# EAGLE schematic proyecto (EAGLE 9.6.2)
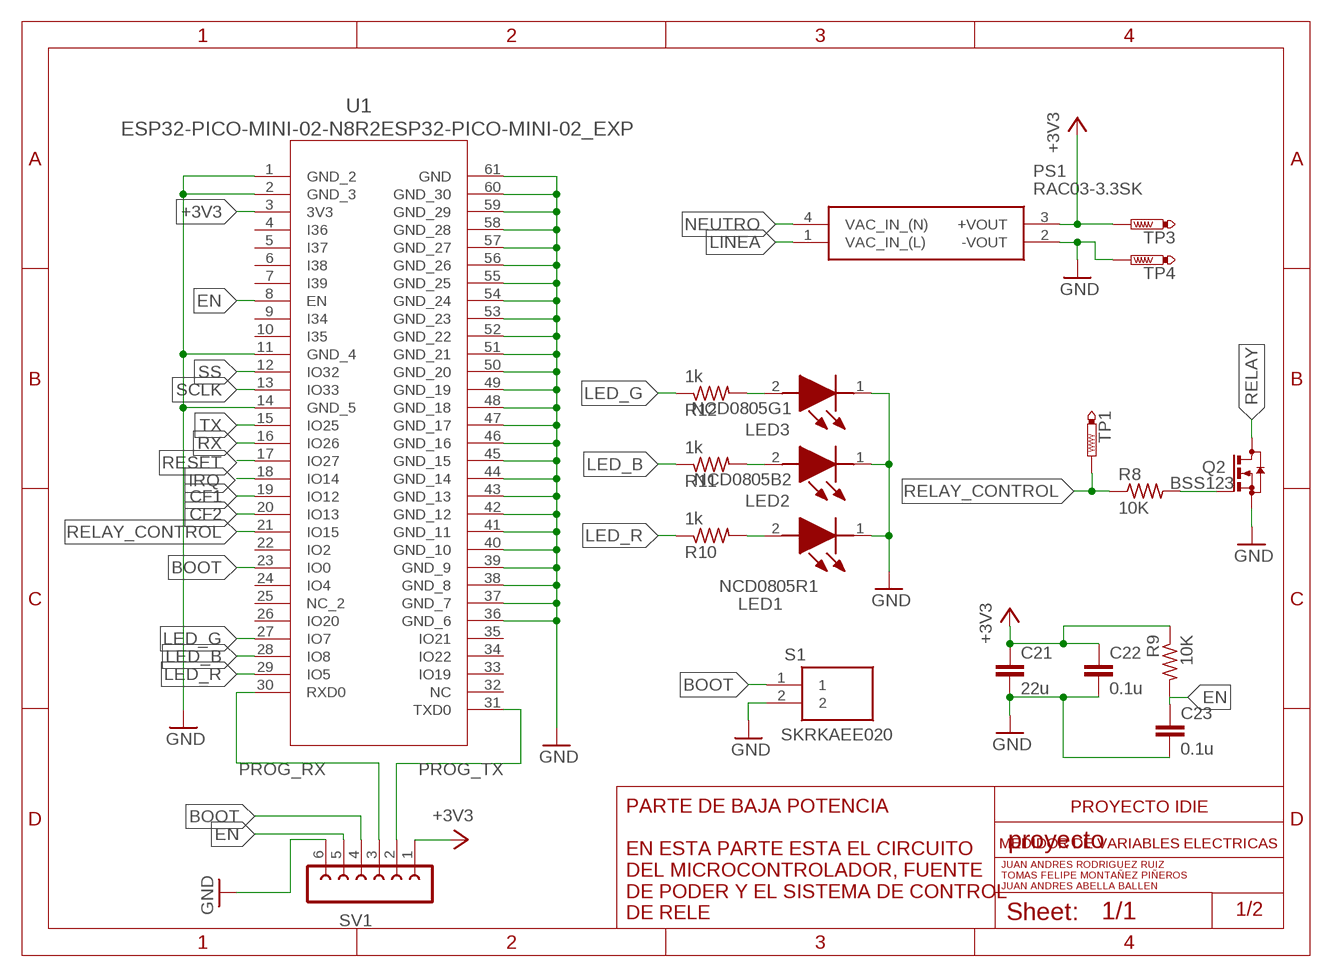
[diagram p0: schematic, sheet 1, part 1 of 2]
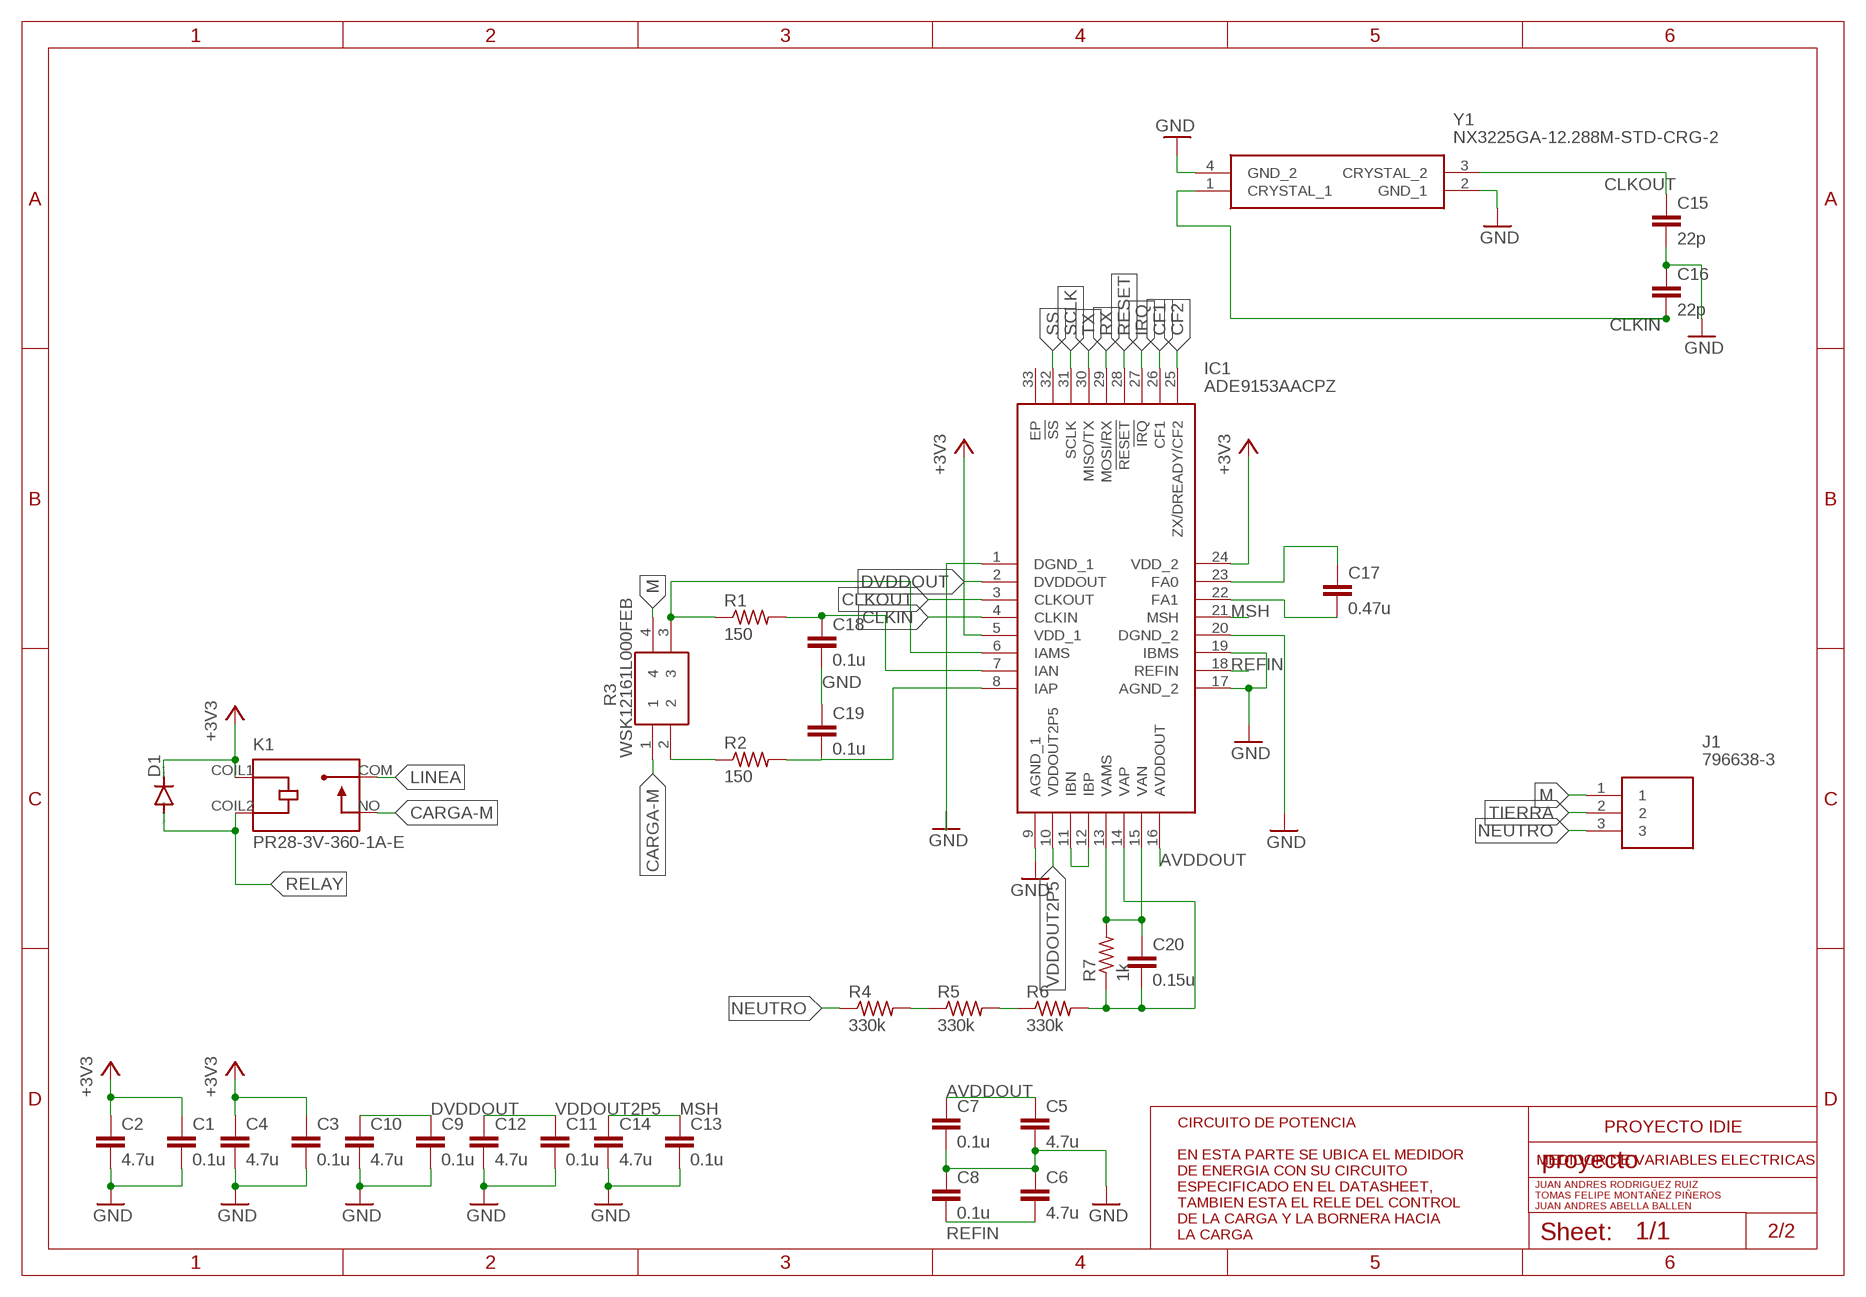
[diagram p1: schematic, sheet 1, part 2 of 2]

## Parts
C1  0.1u  C-EUC0402K  [C0402K]
C2  4.7u  C-EUC0402K  [C0402K]
C3  0.1u  C-EUC0402K  [C0402K]
C4  4.7u  C-EUC0402K  [C0402K]
C5  4.7u  C-EUC0402K  [C0402K]
C6  4.7u  C-EUC0402K  [C0402K]
C7  0.1u  C-EUC0402K  [C0402K]
C8  0.1u  C-EUC0402K  [C0402K]
C9  0.1u  C-EUC0402K  [C0402K]
C10  4.7u  C-EUC0402K  [C0402K]
C11  0.1u  C-EUC0402K  [C0402K]
C12  4.7u  C-EUC0402K  [C0402K]
C13  0.1u  C-EUC0402K  [C0402K]
C14  4.7u  C-EUC0402K  [C0402K]
C15  22p  C-EUC0402K  [C0402K]
C16  22p  C-EUC0402K  [C0402K]
C17  0.47u  C-EUC0402K  [C0402K]
C18  0.1u  C-EUC0402K  [C0402K]
C19  0.1u  C-EUC0402K  [C0402K]
C20  0.15u  C-EUC0402K  [C0402K]
C21  22u  C-EUC0402K  [C0402K]
C22  0.1u  C-EUC0402K  [C0402K]
C23  0.1u  C-EUC0402K  [C0402K]
D1  DIODE-SMB  [SMB]
IC1  ADE9153AACPZ  [QFN50P500X500X80-33N]
J1  796638-3  [SHDRRA3W102P0X508_1X3_1706X120]
K1  PR28-3V-360-1A-E  [RELAY_PR28-3V-360-1A-E]
LED1  NCD0805R1  [LEDC2012X120N]
LED2  NCD0805B2  [LEDC2012X120N]
LED3  NCD0805G1  [LEDC2012X120N]
PS1  RAC03-3.3SK  [RAC0305SK]
Q2  BSS123  [SOT23]
R1  150  R-US_R0402  [R0402]
R2  150  R-US_R0402  [R0402]
R3  WSK12161L000FEB  [WSK12161L000FEB]
R4  330k  R-US_R0603  [R0603]
R5  330k  R-US_R0603  [R0603]
R6  330k  R-US_R0603  [R0603]
R7  1k  R-US_R0603  [R0603]
R8  10K  R-US_R0402  [R0402]
R9  10K  R-US_R0402  [R0402]
R10  1k  R-US_R0402  [R0402]
R11  1k  R-US_R0402  [R0402]
R12  1k  R-US_R0402  [R0402]
S1  SKRKAEE020  [SKRKAEE020]
SV1  FE06-1  [FE06]
TP1  PTR1TP10R  [TP10R]
TP3  PTR1TP10R  [TP10R]
TP4  PTR1TP10R  [TP10R]
U1  ESP32-PICO-MINI-02-N8R2ESP32-PICO-MINI-02_EXP  [ESP32-PICO-MINI-02_EXP]
Y1  NX3225GA-12.288M-STD-CRG-2  [NX3225GA12288MSTDCRG2]

## Nets
+3V3: C1.1 C2.1 C3.1 C4.1 C21.1 C22.1 D1.C IC1.5(VDD_1) IC1.24(VDD_2) K1.COIL1 PS1.3(+VOUT) R9.1 SV1.1 TP3.TP U1.3(3V3)
AVDDOUT: C5.1 C7.1 IC1.16(AVDDOUT)
BOOT: S1.1 SV1.4 U1.23(IO0)
CARGA-M: K1.NO R3.1
CF1: IC1.26(CF1) U1.19(IO12)
CF2: IC1.25(ZX/DREADY/CF2) U1.20(IO13)
CLKIN: C16.2 IC1.4(CLKIN) Y1.1(CRYSTAL_1)
CLKOUT: C15.1 IC1.3(CLKOUT) Y1.3(CRYSTAL_2)
DVDDOUT: C9.1 C10.1 IC1.2(DVDDOUT)
EN: C23.1 R9.2 SV1.5 U1.8(EN)
GND: C1.2 C2.2 C3.2 C4.2 C5.2 C6.1 C7.2 C8.1 C9.2 C10.2 C11.2 C12.2 C13.2 C14.2 C15.2 C16.1 C18.2 C19.1 C21.2 C22.2 C23.2 IC1.1(DGND_1) IC1.9(AGND_1) IC1.17(AGND_2) IC1.19(IBMS) IC1.20(DGND_2) LED1.1(K) LED2.1(K) LED3.1(K) PS1.2(-VOUT) Q2.2(S) S1.2 SV1.6 TP4.TP U1.1(GND_2) U1.2(GND_3) U1.11(GND_4) U1.14(GND_5) U1.36(GND_6) U1.37(GND_7) U1.38(GND_8) U1.39(GND_9) U1.40(GND_10) U1.41(GND_11) U1.42(GND_12) U1.43(GND_13) U1.44(GND_14) U1.45(GND_15) U1.46(GND_16) U1.47(GND_17) U1.48(GND_18) U1.49(GND_19) U1.50(GND_20) U1.51(GND_21) U1.52(GND_22) U1.53(GND_23) U1.54(GND_24) U1.55(GND_25) U1.56(GND_26) U1.57(GND_27) U1.58(GND_28) U1.59(GND_29) U1.60(GND_30) U1.61(GND) Y1.2(GND_1) Y1.4(GND_2)
IRQ: IC1.27(!IRQ) U1.18(IO14)
LED_B: R11.1 U1.28(IO8)
LED_G: R12.1 U1.27(IO7)
LED_R: R10.1 U1.29(IO5)
LINEA: K1.COM PS1.1(VAC_IN_(L))
M: J1.1 R3.4
MSH: C13.1 C14.1 IC1.21(MSH)
N$1: C17.1 IC1.23(FA0)
N$2: IC1.6(IAMS) R1.1 R3.3
N$3: C18.1 IC1.7(IAN) R1.2
N$4: C17.2 IC1.22(FA1)
N$5: C19.2 IC1.8(IAP) R2.2
N$6: R2.1 R3.2
N$7: R4.2 R5.1
N$8: R5.2 R6.1
N$9: C20.2 IC1.14(VAP) R6.2 R7.1
N$10: C20.1 IC1.13(VAMS) IC1.15(VAN) R7.2
N$11: LED1.2(A) R10.2
N$12: LED2.2(A) R11.2
N$13: Q2.1(G) R8.2
N$14: LED3.2(A) R12.2
N$16: IC1.11(IBN) IC1.12(IBP)
NEUTRO: J1.3 PS1.4(VAC_IN_(N)) R4.1
PROG_RX: SV1.3 U1.30(RXD0)
PROG_TX: SV1.2 U1.31(TXD0)
REFIN: C6.2 C8.2 IC1.18(REFIN)
RELAY: D1.A K1.COIL2 Q2.3(D)
RELAY_CONTROL: R8.1 TP1.TP U1.21(IO15)
RESET: IC1.28(!RESET) U1.17(IO27)
RX: IC1.29(MOSI/RX) U1.16(IO26)
SCLK: IC1.31(SCLK) U1.13(IO33)
SS: IC1.32(!SS) U1.12(IO32)
TIERRA: J1.2
TX: IC1.30(MISO/TX) U1.15(IO25)
VDDOUT2P5: C11.1 C12.1 IC1.10(VDDOUT2P5)
Unconnected: IC1.33(EP) U1.4(I36) U1.5(I37) U1.6(I38) U1.7(I39) U1.9(I34) U1.10(I35) U1.22(IO2) U1.24(IO4) U1.25(NC_2) U1.26(IO20) U1.32(NC) U1.33(IO19) U1.34(IO22) U1.35(IO21)

## Notes on the sheet
- PROYECTO IDIE | PROYECTO IDIE
- MEDIDOR DE VARIABLES ELECTRICAS | MEDIDOR DE VARIABLES ELECTRICAS
- JUAN ANDRES RODRIGUEZ RUIZ | JUAN ANDRES RODRIGUEZ RUIZ
- TOMAS FELIPE MONTAÑEZ PIÑEROS | TOMAS FELIPE MONTAÑEZ PIÑEROS
- JUAN ANDRES ABELLA BALLEN | JUAN ANDRES ABELLA BALLEN
- 1/2 | 2/2
- PARTE DE BAJA POTENCIA
  
  EN ESTA PARTE ESTA EL CIRCUITO
  DEL MICROCONTROLADOR, FUENTE
  DE PODER Y EL SISTEMA DE CONTROL
  DE RELE
- CIRCUITO DE POTENCIA
  
  EN ESTA PARTE SE UBICA EL MEDIDOR
  DE ENERGIA CON SU CIRCUITO
  ESPECIFICADO EN EL DATASHEET,
  TAMBIEN ESTA EL RELE DEL CONTROL
  DE LA CARGA Y LA BORNERA HACIA
  LA CARGA

## Library data of the parts
C1-C23 = rcl:C-EU: CAPACITOR, European symbol; SPICEPREFIX: C
D1 = diode:DIODE-: DIODE
IC1 = SamacSys_Parts:ADE9153AACPZ: Data Acquisition ADCs/DACs - Specialized 1 PH Mtr IC w/ Auto Calibration Source: Datasheet <http://www.analog.com/media/en/technical-documentation/data-sheets/ade9153a.pdf>; DESCRIPTION: Data Acquisition ADCs/DACs - Specialized 1 PH Mtr IC w/ Auto Calibration; HEIGHT: 0.8mm; MANUFACTURER_NAME: Analog Devices; MANUFACTURER_PART_NUMBER: ADE9153AACPZ; MOUSER_PART_NUMBER: 584-ADE9153AACPZ; MOUSER_PRICE-STOCK: https://www.mouser.co.uk/ProductDetail/Analog-Devices/ADE9153AACPZ?qs=rrS6PyfT74fO4%2FDiqnqz3A%3D%3D
J1 = SamacSys_Parts:796638-3: Body Features: Primary Product Color Green | Product Orientation Right Angle | Configuration Features: Stacking Configuration Side Stackable | Number of Positions 3 | Number of Rows 1 | Contact Features: Contact Base Material Phosphor Bronze | Contact Current Rating (Max) 15 AMP | Contact Mating Area Plating Material Tin | Dimensions: Wire Size .05 3 MMSQ | Wire Size 30 12 AWG | Electrical Characteristics: Operating Voltage 300 VAC | Housing Features: Housing Material PA 66 | Centerline (Pitch) .2 I Source: Datasheet <https://www.te.com/commerce/DocumentDelivery/DDEController?Action=srchrtrv&DocNm=1-773958-1&DocType=Data Sheet&DocLang=English&PartCntxt=796638-3&DocFormat=pdf>; DESCRIPTION: Body Features: Primary Product Color Green | Product Orientation Right Angle | Configuration Features: Stacking Configuration Side Stackable | Number of Positions 3 | Number of Rows 1 | Contact Features: Contact Base Material Phosphor Bronze | Contact Current Rating (Max) 15 AMP | Contact Mating Area Plating Material Tin | Dimensions: Wire Size .05 3 MMSQ | Wire Size 30 12 AWG | Electrical Characteristics: Operating Voltage 300 VAC | Housing Features: Housing Material PA 66 | Centerline (Pitch) .2 I; HEIGHT: 8.5mm; MANUFACTURER_NAME: TE Connectivity; MANUFACTURER_PART_NUMBER: 796638-3; MOUSER_PART_NUMBER: 571-7966383; MOUSER_PRICE-STOCK: https://www.mouser.co.uk/ProductDetail/TE-Connectivity/796638-3?qs=OgP1KchuM4OaLB9LUcSrBQ%3D%3D
K1 = PR28-3V-360-1A-E:PR28-3V-360-1A-E: Check availability <https://pricing.snapeda.com/parts/PR28-3V-360-1A-E/CUI%20Devices/view-part?ref=eda>; AVAILABILITY: In Stock; CHECK_PRICES: https://www.snapeda.com/parts/PR28-3V-360-1A-E/Same+Sky/view-part/?ref=eda; CUI_PURCHASE_URL: https://www.cuidevices.com/product/relays/power-relays/pr28-3v-360-1a-e?utm_source=snapeda.com&utm_medium=referral&utm_campaign=snapedaBOM; DESCRIPTION: 22 x 16 x 16.6 mm, 3 V, 16 A, SPST (1 Form A), Epoxy Sealed, Class F, Power Relay; MF: CUI Devices; MP: PR28-3V-360-1A-E; PACKAGE: None; PRICE: None; PURCHASE-URL: https://www.snapeda.com/api/url_track_click_mouser/?unipart_id=15935205&manufacturer=CUI Devices&part_name=PR28-3V-360-1A-E&search_term=None; SNAPEDA_LINK: https://www.snapeda.com/parts/PR28-3V-360-1A-E/Same+Sky/view-part/?ref=snap
LED1 = SamacSys_Parts:NCD0805R1: LED Chip Light Emitting Diode Source: Datasheet <https://datasheet.lcsc.com/lcsc/2008201032_Foshan-NationStar-Optoelectronics-NCD0805R1_C84256.pdf>; DESCRIPTION: LED Chip Light Emitting Diode; HEIGHT: 1.2mm; MANUFACTURER_NAME: Foshan NationStar Optoelectronics; MANUFACTURER_PART_NUMBER: NCD0805R1
LED2 = libreria_propia:NCD0805B2: LED Chip Light Emitting Diode Source: Datasheet <https://www.lcsc.com/datasheet/lcsc_datasheet_2008201032_Foshan-NationStar-Optoelectronics-NCD0805B2_C84259.pdf>
LED3 = libreria_propia:NCD0805G1: LED Chip Light Emitting Diode Source: Datasheet <https://www.lcsc.com/datasheet/lcsc_datasheet_2406121610_Foshan-NationStar-Optoelectronics-NCD0805G1_C84260.pdf>
PS1 = SamacSys_Parts:RAC03-3.3SK: AC/DC Power Modules 3W 85-264Vin 3.3Vout 900mA Source: Datasheet <https://recom-power.com/pdf/Powerline_AC-DC/RAC03-K.pdf>; DESCRIPTION: AC/DC Power Modules 3W 85-264Vin 3.3Vout 900mA; HEIGHT: 18.4mm; MANUFACTURER_NAME: RECOM Power; MANUFACTURER_PART_NUMBER: RAC03-3.3SK; MOUSER_PART_NUMBER: 919-RAC03-3.3SK; MOUSER_PRICE-STOCK: https://www.mouser.co.uk/ProductDetail/RECOM-Power/RAC03-3.3SK?qs=EBDBlbfErPyS11fagCV%252BCw%3D%3D
Q2 = transistor-small-signal:BSS123: N-CHANNEL MOS FET
R1 R2 R4-R12 = rcl:R-US_: RESISTOR, American symbol; SPICEPREFIX: R
R3 = SamacSys_Parts:WSK12161L000FEB: Current Sense Resistors - SMD .001 OHM 1% 3W 50PPM Source: Datasheet <https://www.vishay.com/docs/30189/wsk1216.pdf>; DESCRIPTION: Current Sense Resistors - SMD .001 OHM 1% 3W 50PPM; HEIGHT: 1.9mm; MANUFACTURER_NAME: Vishay; MANUFACTURER_PART_NUMBER: WSK12161L000FEB; MOUSER_PART_NUMBER: 71-WSK12161L000FEB; MOUSER_PRICE-STOCK: https://www.mouser.co.uk/ProductDetail/Vishay-Dale/WSK12161L000FEB?qs=jj7GbYRQuOZg3vJxu0nEzw%3D%3D
S1 = SamacSys_Parts:SKRKAEE020: Tactile Switches 3.9x2.9x2.0mm 160gf Packaging Temp 80oC Source: Datasheet <http://www.alps.com/prod/info/J/HTML/Tact/SurfaceMount/SKRK/SKRKAEE020.html>; DESCRIPTION: Tactile Switches 3.9x2.9x2.0mm 160gf Packaging Temp 80oC; HEIGHT: 2mm; MANUFACTURER_NAME: ALPS Electric; MANUFACTURER_PART_NUMBER: SKRKAEE020; MOUSER_PART_NUMBER: 688-SKRKAEE020; MOUSER_PRICE-STOCK: https://www.mouser.co.uk/ProductDetail/Alps-Alpine/SKRKAEE020?qs=MrosSN5%252BUQW89XjXIp8Ugw%3D%3D
SV1 = con-lsta:FE06-1: FEMALE HEADER; OC_FARNELL: unknown; OC_NEWARK: unknown
TP1 TP3 TP4 = testpad:PTR1: TEST PIN
U1 = 2024-09-07_16-09-34_Library:ESP32-PICO-MINI-02-N8R2; COPYRIGHT: Copyright (C) 2024 Ultra Librarian. All rights reserved.; MANUFACTURER_PART_NUMBER: ESP32-PICO-MINI-02-N8R2; MFR_NAME: Espressif Systems
Y1 = SamacSys_Parts:NX3225GA-12.288M-STD-CRG-2: NDK 12.28MHz Crystal Unit +/-20ppm SMD 4-Pin 3.2 x 2.5 x 0.75mm Source: Datasheet <https://datasheet.datasheetarchive.com/originals/distributors/DKDS-17/332077.pdf>; DESCRIPTION: NDK 12.28MHz Crystal Unit +/-20ppm SMD 4-Pin 3.2 x 2.5 x 0.75mm; HEIGHT: 0.9mm; MANUFACTURER_NAME: NDK; MANUFACTURER_PART_NUMBER: NX3225GA-12.288M-STD-CRG-2